# Altium schematic sheet Fuel Cell Schematic.SchDoc
size B; SheetNumber: 1; SheetTotal: 13
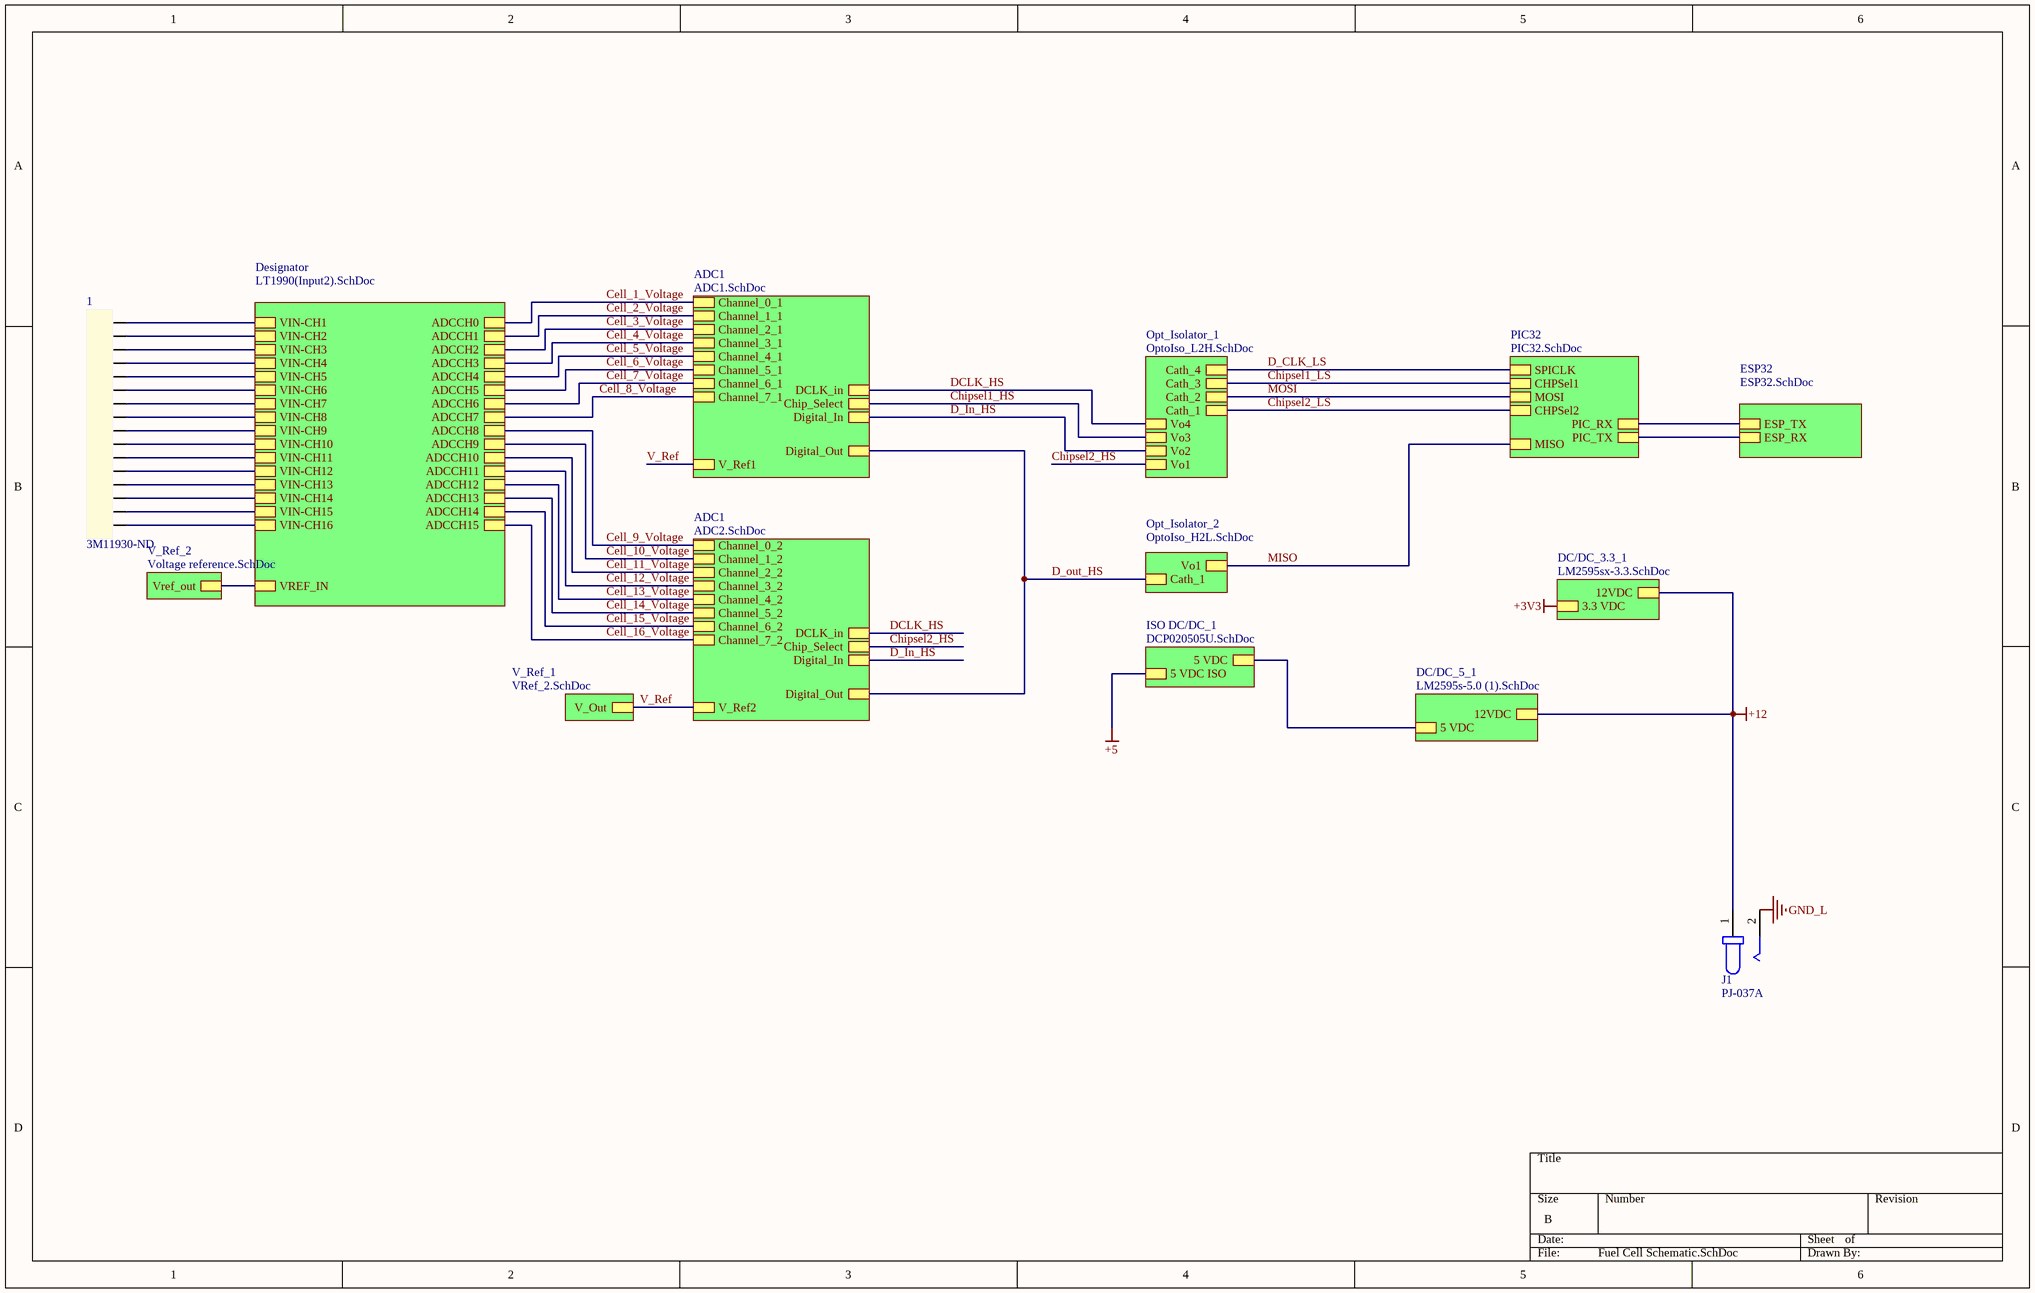
[diagram p0: Fuel Cell Schematic.SchDoc]

## Parts
1  Supplier Part Number 1: 3M11930-ND  [IDC Connector_16POS_2Layer]
J1  PJ-037A  [CUI_PJ-037A]

## Sub-sheets
ADC1 = ADC1.SchDoc: DCLK_in, Chip_Select, Digital_In, Digital_Out, Channel_0_1, Channel_1_1, Channel_2_1, Channel_3_1, Channel_4_1, Channel_5_1, Channel_6_1, Channel_7_1, V_Ref1
ADC1 = ADC2.SchDoc: DCLK_in, Chip_Select, Digital_In, Digital_Out, Channel_0_2, Channel_1_2, Channel_2_2, Channel_3_2, Channel_4_2, Channel_5_2, Channel_6_2, Channel_7_2, V_Ref2
DC/DC_3.3_1 = LM2595sx-3.3.SchDoc: 12VDC, 3.3 VDC
DC/DC_5_1 = LM2595s-5.0 (1).SchDoc: 12VDC, 5 VDC
Designator = LT1990(Input2).SchDoc: ADCCH1, ADCCH2, ADCCH3, VIN-CH3, ADCCH4, VIN-CH4, VIN-CH5, ADCCH5, VIN-CH6, ADCCH6, ADCCH7, ADCCH8, VIN-CH8, ADCCH9, VIN-CH9, ADCCH10, VIN-CH10, ADCCH11, VIN-CH11, ADCCH12, VIN-CH12, ADCCH13, VIN-CH13, ADCCH14, VIN-CH14, ADCCH15, VIN-CH15, VIN-CH16, VIN-CH2, ADCCH0, VIN-CH1, VREF_IN, VIN-CH7
ESP32 = ESP32.SchDoc: ESP_TX, ESP_RX
ISO DC/DC_1 = DCP020505U.SchDoc: 5 VDC, 5 VDC ISO
Opt_Isolator_1 = OptoIso_L2H.SchDoc: Vo4, Vo3, Vo2, Cath_4, Cath_3, Cath_2, Cath_1, Vo1
Opt_Isolator_2 = OptoIso_H2L.SchDoc: Cath_1, Vo1
PIC32 = PIC32.SchDoc: CHPSel2, MOSI, CHPSel1, PIC_TX, PIC_RX, MISO, SPICLK
V_Ref_1 = VRef_2.SchDoc: V_Out
V_Ref_2 = Voltage reference.SchDoc: Vref_out

## Nets
+3V3: sheet DC/DC_3.3_1/3.3 VDC
+5: sheet ISO DC/DC_1/5 VDC ISO
+12: J1.1 ; sheet DC/DC_3.3_1/12VDC, sheet DC/DC_5_1/12VDC
GND_L: J1.2
Cell_1_Voltage: sheet ADC1/Channel_0_1, sheet Designator/ADCCH0
Cell_2_Voltage: sheet ADC1/Channel_1_1, sheet Designator/ADCCH1
Cell_3_Voltage: sheet ADC1/Channel_2_1, sheet Designator/ADCCH2
Cell_4_Voltage: sheet ADC1/Channel_3_1, sheet Designator/ADCCH3
Cell_5_Voltage: sheet ADC1/Channel_4_1, sheet Designator/ADCCH4
Cell_6_Voltage: sheet ADC1/Channel_5_1, sheet Designator/ADCCH5
Cell_7_Voltage: sheet ADC1/Channel_6_1, sheet Designator/ADCCH6
Cell_8_Voltage: sheet ADC1/Channel_7_1, sheet Designator/ADCCH7
Cell_9_Voltage: sheet ADC1/Channel_0_2, sheet Designator/ADCCH8
Cell_10_Voltage: sheet ADC1/Channel_1_2, sheet Designator/ADCCH9
Cell_11_Voltage: sheet ADC1/Channel_2_2, sheet Designator/ADCCH10
Cell_12_Voltage: sheet ADC1/Channel_3_2, sheet Designator/ADCCH11
Cell_13_Voltage: sheet ADC1/Channel_4_2, sheet Designator/ADCCH12
Cell_14_Voltage: sheet ADC1/Channel_5_2, sheet Designator/ADCCH13
Cell_15_Voltage: sheet ADC1/Channel_6_2, sheet Designator/ADCCH14
Cell_16_Voltage: sheet ADC1/Channel_7_2, sheet Designator/ADCCH15
Chipsel1_HS: sheet ADC1/Chip_Select, sheet Opt_Isolator_1/Vo3
Chipsel1_LS: sheet Opt_Isolator_1/Cath_3, sheet PIC32/CHPSel1
Chipsel2_HS: sheet Opt_Isolator_1/Vo1, sheet ADC1/Chip_Select
Chipsel2_LS: sheet Opt_Isolator_1/Cath_1, sheet PIC32/CHPSel2
D_CLK_LS: sheet Opt_Isolator_1/Cath_4, sheet PIC32/SPICLK
D_In_HS: sheet ADC1/Digital_In, sheet Opt_Isolator_1/Vo2, sheet ADC1/Digital_In
D_out_HS: sheet ADC1/Digital_Out, sheet Opt_Isolator_2/Cath_1, sheet ADC1/Digital_Out
DCLK_HS: sheet ADC1/DCLK_in, sheet Opt_Isolator_1/Vo4, sheet ADC1/DCLK_in
MISO: sheet Opt_Isolator_2/Vo1, sheet PIC32/MISO
MOSI: sheet Opt_Isolator_1/Cath_2, sheet PIC32/MOSI
V_Ref: sheet ADC1/V_Ref1, sheet ADC1/V_Ref2, sheet V_Ref_1/V_Out
Net1_1: 1.1 ; sheet Designator/VIN-CH1
Net1_2: 1.2 ; sheet Designator/VIN-CH2
Net1_3: 1.3 ; sheet Designator/VIN-CH3
Net1_4: 1.4 ; sheet Designator/VIN-CH4
Net1_5: 1.5 ; sheet Designator/VIN-CH5
Net1_6: 1.6 ; sheet Designator/VIN-CH6
Net1_7: 1.7 ; sheet Designator/VIN-CH7
Net1_8: 1.8 ; sheet Designator/VIN-CH8
Net1_9: 1.9 ; sheet Designator/VIN-CH9
Net1_10: 1.10 ; sheet Designator/VIN-CH10
Net1_11: 1.11 ; sheet Designator/VIN-CH11
Net1_12: 1.12 ; sheet Designator/VIN-CH12
Net1_13: 1.13 ; sheet Designator/VIN-CH13
Net1_14: 1.14 ; sheet Designator/VIN-CH14
Net1_15: 1.15 ; sheet Designator/VIN-CH15
Net1_16: 1.16 ; sheet Designator/VIN-CH16
(unnamed): sheet Designator/VREF_IN, sheet V_Ref_2/Vref_out
(unnamed): sheet ISO DC/DC_1/5 VDC, sheet DC/DC_5_1/5 VDC
(unnamed): sheet ESP32/ESP_TX, sheet PIC32/PIC_RX
(unnamed): sheet ESP32/ESP_RX, sheet PIC32/PIC_TX

## Library data of the parts
1 = 30316-5002HB: Conn Shrouded Header (4 Sides) HDR 16 POS 2.54mm Solder RA Side Entry Thru-Hole Box; Manufacturer: 3M; Gender: Male; Current Rating: 1A; Number of Positions: 16; Connector Type: Male Pin; Row Spacing: 0.1inch; Supplier 1: Digi-Key; Manufacturer Part Number: 30316-5002HB; RoHS: Yes; Category: Connectors; Stock 1: 5922; Pricing 1: 1=1.55000, 10=1.35200, 100=1.20850, 500=1.00712, 1000=0.86325, 5000=0.76541, 10000=0.74815 (USD); Mounting Technology: Through Hole; Contact Plating: Gold; Contact Material: Brass; Color: Black; Housing Material: Polyester; Housing Color: Black; Min Operating Temperature: -55°C; Max Operating Temperature: 105°C; Number of Rows: 2; Termination: Solder; Package Quantity: 1000; Packaging: Bulk; Series: 303; Contact Type: Male Pin; Orientation: Right Angle; Max Current Rating: 1A; Length: 27.9mm; Pitch: 2.54mm; Contact Mating Length: 0.236inch; Depth: 13.26mm; Lead Free: Lead Free; RoHS Compliant: Yes; ComponentLink1URL: https://datasheet.ciiva.com/6832/ts0818-6832733.pdf?src-supplier=Digi-Key; ComponentLink1Description: https://datasheet.ciiva.com/6832/ts0818-6832733.pdf?src-supplier=Digi-Key
J1 = PJ-037A: 2.0 mm Center Pin, 2.5 A, Right Angle, Through Hole, Dc Power Jack Connector; Value: *; Price: None; MP: PJ-037A; Availability: Unavailable; Package: None